# Altium schematic sheet Sch1.SchDoc
size A3
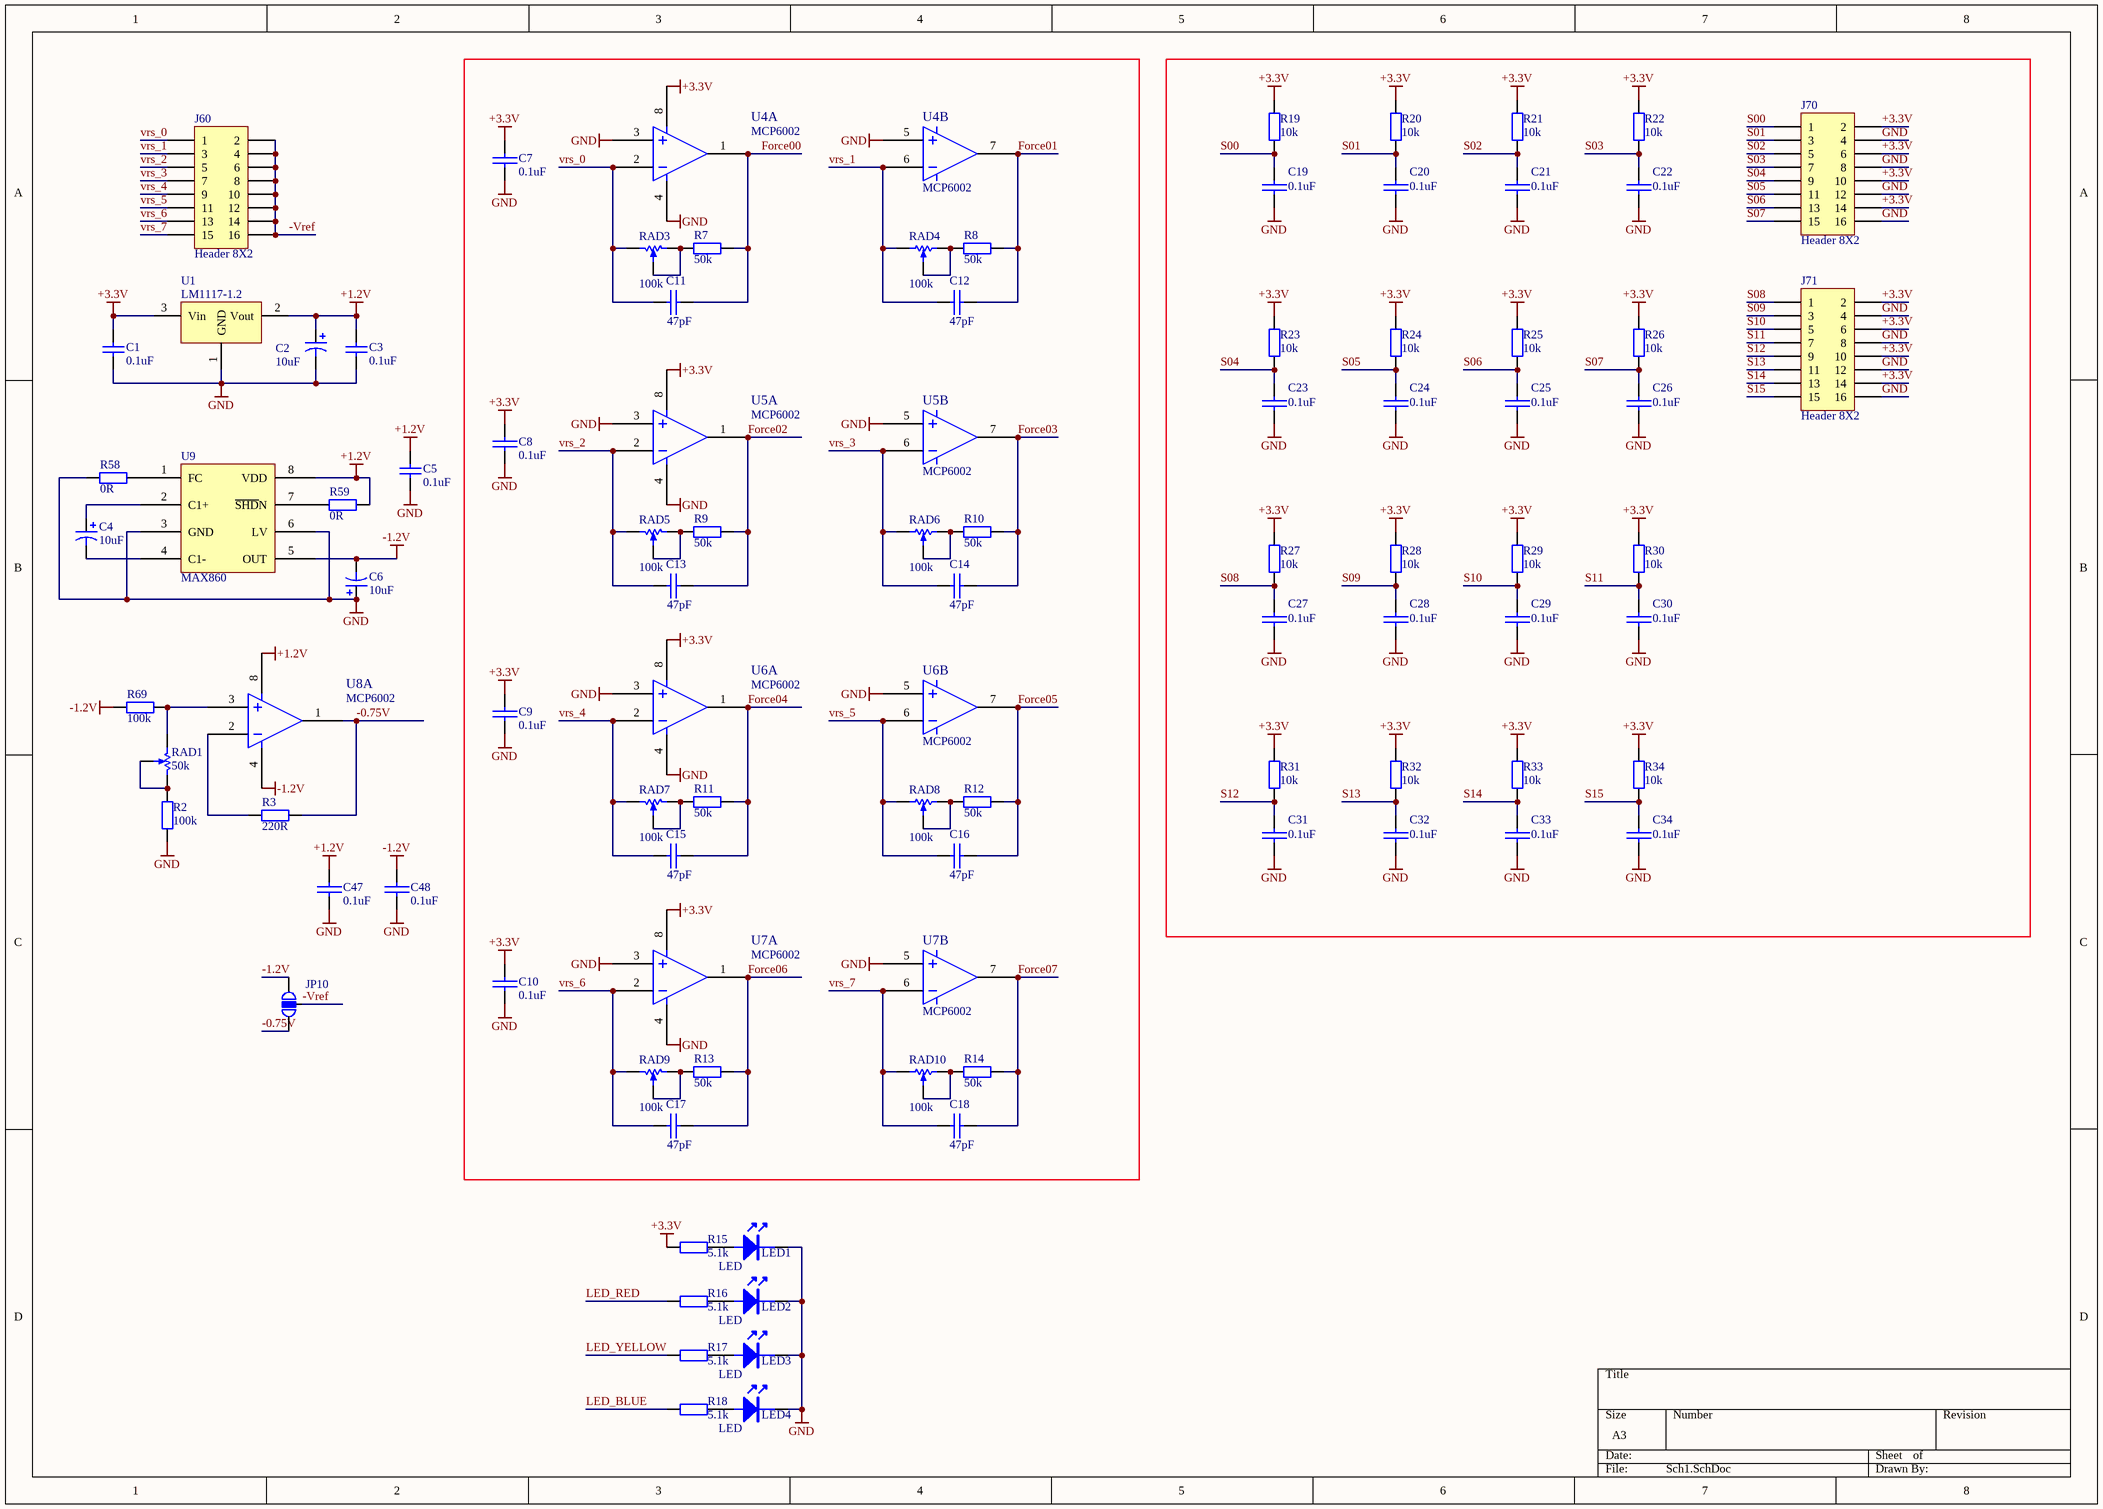
[diagram p0: Sch1.SchDoc]

## Parts
C1  value 0.1uF  [CC0603]  (hidden comment: 0603-50V-0.1uF)
C2  value 10uF  [SMD-EC-F5]  (hidden comment: CD-50V-10uF-F5(SMD))
C3  value 0.1uF  [CC0603]  (hidden comment: 0603-50V-0.1uF)
C4  value 10uF  [SMD-EC-F5]  (hidden comment: CD-50V-10uF-F5(SMD))
C5  value 0.1uF  [CC0603]  (hidden comment: 0603-50V-0.1uF)
C6  value 10uF  [SMD-EC-F5]  (hidden comment: CD-50V-10uF-F5(SMD))
C7  value 0.1uF  [CC0603]  (hidden comment: 0603-50V-0.1uF)
C8  value 0.1uF  [CC0603]  (hidden comment: 0603-50V-0.1uF)
C9  value 0.1uF  [CC0603]  (hidden comment: 0603-50V-0.1uF)
C10  value 0.1uF  [CC0603]  (hidden comment: 0603-50V-0.1uF)
C11  value 47pF  [CC0603]  (hidden comment: 0603-50V-47pF)
C12  value 47pF  [CC0603]  (hidden comment: 0603-50V-47pF)
C13  value 47pF  [CC0603]  (hidden comment: 0603-50V-47pF)
C14  value 47pF  [CC0603]  (hidden comment: 0603-50V-47pF)
C15  value 47pF  [CC0603]  (hidden comment: 0603-50V-47pF)
C16  value 47pF  [CC0603]  (hidden comment: 0603-50V-47pF)
C17  value 47pF  [CC0603]  (hidden comment: 0603-50V-47pF)
C18  value 47pF  [CC0603]  (hidden comment: 0603-50V-47pF)
C19  value 0.1uF  [CC0603]  (hidden comment: 0603-50V-0.1uF)
C20  value 0.1uF  [CC0603]  (hidden comment: 0603-50V-0.1uF)
C21  value 0.1uF  [CC0603]  (hidden comment: 0603-50V-0.1uF)
C22  value 0.1uF  [CC0603]  (hidden comment: 0603-50V-0.1uF)
C23  value 0.1uF  [CC0603]  (hidden comment: 0603-50V-0.1uF)
C24  value 0.1uF  [CC0603]  (hidden comment: 0603-50V-0.1uF)
C25  value 0.1uF  [CC0603]  (hidden comment: 0603-50V-0.1uF)
C26  value 0.1uF  [CC0603]  (hidden comment: 0603-50V-0.1uF)
C27  value 0.1uF  [CC0603]  (hidden comment: 0603-50V-0.1uF)
C28  value 0.1uF  [CC0603]  (hidden comment: 0603-50V-0.1uF)
C29  value 0.1uF  [CC0603]  (hidden comment: 0603-50V-0.1uF)
C30  value 0.1uF  [CC0603]  (hidden comment: 0603-50V-0.1uF)
C31  value 0.1uF  [CC0603]  (hidden comment: 0603-50V-0.1uF)
C32  value 0.1uF  [CC0603]  (hidden comment: 0603-50V-0.1uF)
C33  value 0.1uF  [CC0603]  (hidden comment: 0603-50V-0.1uF)
C34  value 0.1uF  [CC0603]  (hidden comment: 0603-50V-0.1uF)
C47  value 0.1uF  [CC0603]  (hidden comment: 0603-50V-0.1uF)
C48  value 0.1uF  [CC0603]  (hidden comment: 0603-50V-0.1uF)
J60  Header 8X2  [HDR2X8]
J70  Header 8X2  [HDR2X8]
J71  Header 8X2  [HDR2X8]
JP10  Jumper  [HDR1X3]  (value not drawn)
LED1  value LED  [LED-R3]  (hidden comment: LED-φ3(翠绿))
LED2  value LED  [LED-R3]  (hidden comment: LED-φ3(红))
LED3  value LED  [LED-R3]  (hidden comment: LED-φ3(黄))
LED4  value LED  [LED-R3]  (hidden comment: LED-φ3(蓝))
R2  value 100k  [0603]  (hidden comment: 0603-100kΩ±1％)
R3  value 220R  [0603]  (hidden comment: 0603-220Ω±1％)
R7  value 50k  [0603]  (hidden comment: 0603-50kΩ±1％)
R8  value 50k  [0603]  (hidden comment: 0603-50kΩ±1％)
R9  value 50k  [0603]  (hidden comment: 0603-50kΩ±1％)
R10  value 50k  [0603]  (hidden comment: 0603-50kΩ±1％)
R11  value 50k  [0603]  (hidden comment: 0603-50kΩ±1％)
R12  value 50k  [0603]  (hidden comment: 0603-50kΩ±1％)
R13  value 50k  [0603]  (hidden comment: 0603-50kΩ±1％)
R14  value 50k  [0603]  (hidden comment: 0603-50kΩ±1％)
R15  value 5.1k  [0603]  (hidden comment: 0603-5.1kΩ±1％)
R16  value 5.1k  [0603]  (hidden comment: 0603-5.1kΩ±1％)
R17  value 5.1k  [0603]  (hidden comment: 0603-5.1kΩ±1％)
R18  value 5.1k  [0603]  (hidden comment: 0603-5.1kΩ±1％)
R19  value 10k  [0603]  (hidden comment: 0603-10kΩ±1％)
R20  value 10k  [0603]  (hidden comment: 0603-10kΩ±1％)
R21  value 10k  [0603]  (hidden comment: 0603-10kΩ±1％)
R22  value 10k  [0603]  (hidden comment: 0603-10kΩ±1％)
R23  value 10k  [0603]  (hidden comment: 0603-10kΩ±1％)
R24  value 10k  [0603]  (hidden comment: 0603-10kΩ±1％)
R25  value 10k  [0603]  (hidden comment: 0603-10kΩ±1％)
R26  value 10k  [0603]  (hidden comment: 0603-10kΩ±1％)
R27  value 10k  [0603]  (hidden comment: 0603-10kΩ±1％)
R28  value 10k  [0603]  (hidden comment: 0603-10kΩ±1％)
R29  value 10k  [0603]  (hidden comment: 0603-10kΩ±1％)
R30  value 10k  [0603]  (hidden comment: 0603-10kΩ±1％)
R31  value 10k  [0603]  (hidden comment: 0603-10kΩ±1％)
R32  value 10k  [0603]  (hidden comment: 0603-10kΩ±1％)
R33  value 10k  [0603]  (hidden comment: 0603-10kΩ±1％)
R34  value 10k  [0603]  (hidden comment: 0603-10kΩ±1％)
R58  value 0R  [0603]  (hidden comment: 0603-0Ω±1％)
R59  value 0R  [0603]  (hidden comment: 0603-0Ω±1％)
R69  value 100k  [0603]  (hidden comment: 0603-100kΩ±1％)
RAD1  value 50k  [3224W]  (hidden comment: 3224W-50k)
RAD3  value 100k  [3224W]  (hidden comment: 3224W-100k)
RAD4  value 100k  [3224W]  (hidden comment: 3224W-100k)
RAD5  value 100k  [3224W]  (hidden comment: 3224W-100k)
RAD6  value 100k  [3224W]  (hidden comment: 3224W-100k)
RAD7  value 100k  [3224W]  (hidden comment: 3224W-100k)
RAD8  value 100k  [3224W]  (hidden comment: 3224W-100k)
RAD9  value 100k  [3224W]  (hidden comment: 3224W-100k)
RAD10  value 100k  [3224W]  (hidden comment: 3224W-100k)
U1  value LM1117-1.2  [SOT223]  (hidden comment: LM1117GS-1.2)
U4  MCP6002  [SO-8]  (parts A,B of 2)
U5  MCP6002  [SO-8]  (parts A,B of 2)
U6  MCP6002  [SO-8]  (parts A,B of 2)
U7  MCP6002  [SO-8]  (parts A,B of 2)
U8  MCP6002  [SO-8]  (part A of 2)
U9  max860  [SO-8]

## Nets
+1.2V: C2.1 C3.2 C5.2 C47.2 R59.2 U1.2(Vout) U8.8 U9.8(VDD)
+3.3V: C1.2 C7.2 C8.2 C9.2 C10.2 J70.2 J70.6 J70.10 J70.14 J71.2 J71.6 J71.10 J71.14 R15.2 R19.1 R20.1 R21.1 R22.1 R23.1 R24.1 R25.1 R26.1 R27.1 R28.1 R29.1 R30.1 R31.1 R32.1 R33.1 R34.1 U1.3(Vin) U4.8 U5.8 U6.8 U7.8
-1.2V: C6.2 C48.2 JP10.1(A) R69.2 U8.4 U9.5(OUT)
GND: C1.1 C2.2 C3.1 C5.1 C6.1 C7.1 C8.1 C9.1 C10.1 C19.2 C20.2 C21.2 C22.2 C23.2 C24.2 C25.2 C26.2 C27.2 C28.2 C29.2 C30.2 C31.2 C32.2 C33.2 C34.2 C47.1 C48.1 J70.4 J70.8 J70.12 J70.16 J71.4 J71.8 J71.12 J71.16 LED1.2 LED2.2 LED3.2 LED4.2 R2.1 R58.1 U1.1(GND) U4.3 U4.4 U4.5 U5.3 U5.4 U5.5 U6.3 U6.4 U6.5 U7.3 U7.4 U7.5 U9.3(GND) U9.6(LV)
-0.75V: JP10.3(B) R3.2 U8.1
-Vref: J60.2 J60.4 J60.6 J60.8 J60.10 J60.12 J60.14 J60.16 JP10.2(B)
Force00: C11.1 R7.2 U4.1
Force01: C12.1 R8.1 U4.7
Force02: C13.1 R9.2 U5.1
Force03: C14.1 R10.1 U5.7
Force04: C15.1 R11.2 U6.1
Force05: C16.1 R12.1 U6.7
Force06: C17.1 R13.2 U7.1
Force07: C18.1 R14.1 U7.7
LED_BLUE: R18.2
LED_RED: R16.2
LED_YELLOW: R17.2
S00: C19.1 J70.1 R19.2
S01: C20.1 J70.3 R20.2
S02: C21.1 J70.5 R21.2
S03: C22.1 J70.7 R22.2
S04: C23.1 J70.9 R23.2
S05: C24.1 J70.11 R24.2
S06: C25.1 J70.13 R25.2
S07: C26.1 J70.15 R26.2
S08: C27.1 J71.1 R27.2
S09: C28.1 J71.3 R28.2
S10: C29.1 J71.5 R29.2
S11: C30.1 J71.7 R30.2
S12: C31.1 J71.9 R31.2
S13: C32.1 J71.11 R32.2
S14: C33.1 J71.13 R33.2
S15: C34.1 J71.15 R34.2
vrs_0: C11.2 J60.1 RAD3.3(CW) U4.2
vrs_1: C12.2 J60.3 RAD4.1(CCW) U4.6
vrs_2: C13.2 J60.5 RAD5.3(CW) U5.2
vrs_3: C14.2 J60.7 RAD6.1(CCW) U5.6
vrs_4: C15.2 J60.9 RAD7.3(CW) U6.2
vrs_5: C16.2 J60.11 RAD8.1(CCW) U6.6
vrs_6: C17.2 J60.13 RAD9.3(CW) U7.2
vrs_7: C18.2 J60.15 RAD10.1(CCW) U7.6
NetC4_1: C4.1 U9.2(C1+)
NetC4_2: C4.2 U9.4(C1-)
NetLED1_1: LED1.1 R15.1
NetLED2_1: LED2.1 R16.1
NetLED3_1: LED3.1 R17.1
NetLED4_1: LED4.1 R18.1
NetR2_2: R2.2 RAD1.1(CCW) RAD1.2(W)
NetR3_1: R3.1 U8.2
NetR7_1: R7.1 RAD3.1(CCW) RAD3.2(W)
NetR8_2: R8.2 RAD4.2(W) RAD4.3(CW)
NetR9_1: R9.1 RAD5.1(CCW) RAD5.2(W)
NetR10_2: R10.2 RAD6.2(W) RAD6.3(CW)
NetR11_1: R11.1 RAD7.1(CCW) RAD7.2(W)
NetR12_2: R12.2 RAD8.2(W) RAD8.3(CW)
NetR13_1: R13.1 RAD9.1(CCW) RAD9.2(W)
NetR14_2: R14.2 RAD10.2(W) RAD10.3(CW)
NetR58_2: R58.2 U9.1(FC)
NetR59_1: R59.1 U9.7(~{SHD}N)
NetR69_1: R69.1 RAD1.3(CW) U8.3

## Library data of the parts
C1 C3 C5 = Cap: 贴片电容
C2 C4 C6 = Cap Pol1: 贴片铝电解电容
C7-C34 C47 C48 = CAP: 贴片电容
J60 J70 J71 = Header 8X2: 排针; Value: 2.54mm 2x8P双排针
JP10 = Bell: Value: 2.54mm 3P单排针
LED1-LED4 = LED: 发光二极管
R2 R3 R7-R14 R19-R34 R58 R59 R69 = Res2: 贴片电阻
R15-R18 = Res2: 贴片电阻器
RAD1 RAD3-RAD10 = RPot SM: 贴片电位器
U1 = 78: 三端稳压器
U4-U8 = 1458: 集成电路; Value: MCP6002
U9 = max860: 集成电路; Value: MAX860